# Altium schematic sheet Power Source.SchDoc: Power Architechture Block Diagram
size A3; DocumentNumber: 2; SheetNumber: 2; SheetTotal: 54
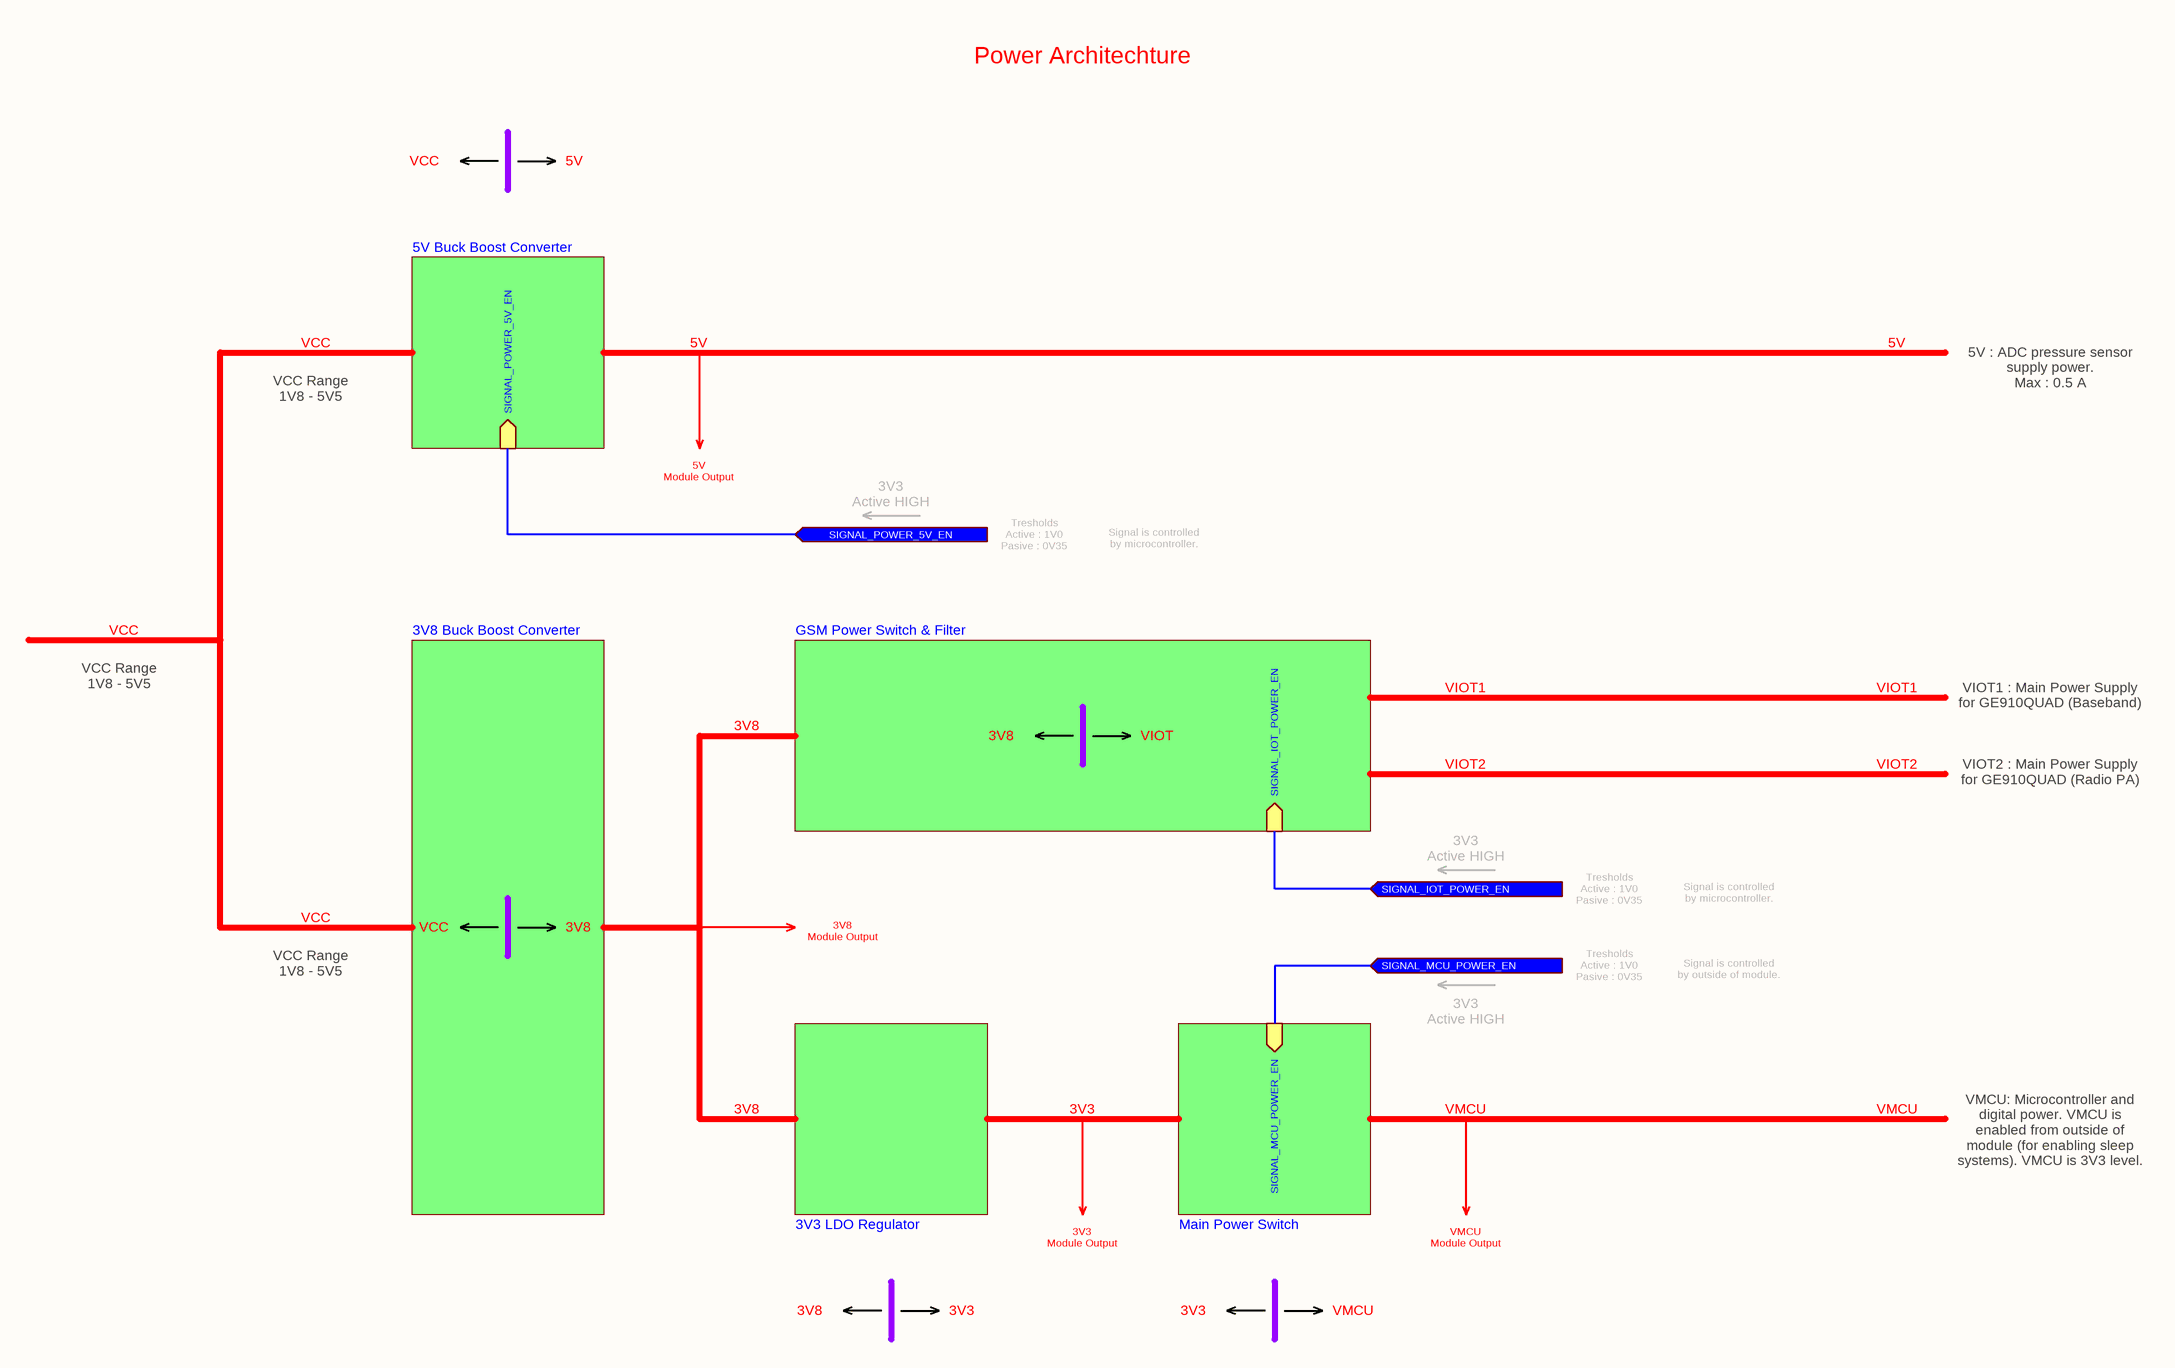
[diagram p0: Power Source.SchDoc]

## Sub-sheets
3V3 LDO Regulator = 3V3 LDO Regulator.SchDoc: no entries
3V8 Buck Boost Converter = 3V8 Buck Boost Converter.SchDoc: no entries
5V Buck Boost Converter = 5V Buck Boost Converter.SchDoc: SIGNAL_POWER_5V_EN (in)
GSM Power Switch & Filter = GSM Power.SchDoc: SIGNAL_IOT_POWER_EN (in)
Main Power Switch = Main Power Switch.SchDoc: SIGNAL_MCU_POWER_EN (in)

## Ports
SIGNAL_IOT_POWER_EN (in), SIGNAL_MCU_POWER_EN (in), SIGNAL_POWER_5V_EN (in)

## Nets
SIGNAL_IOT_POWER_EN: port SIGNAL_IOT_POWER_EN, sheet GSM Power Switch & Filter/SIGNAL_IOT_POWER_EN
SIGNAL_MCU_POWER_EN: port SIGNAL_MCU_POWER_EN, sheet Main Power Switch/SIGNAL_MCU_POWER_EN
SIGNAL_POWER_5V_EN: port SIGNAL_POWER_5V_EN, sheet 5V Buck Boost Converter/SIGNAL_POWER_5V_EN

## Notes on the sheet
- Power Architechture
- VCC
- 5V
- VCC Range
  1V8 - 5V5
- 5V
  Module Output
- 5V : ADC pressure sensor supply power.
  Max : 0.5 A
- 3V3
  Active HIGH
- Tresholds
  Active : 1V0
  Pasive : 0V35
- Signal is controlled by microcontroller.
- 3V8
- VIOT
- VIOT2
- VIOT1
- VIOT1 : Main Power Supply for GE910QUAD (Baseband)
- VIOT2 : Main Power Supply for GE910QUAD (Radio PA)
- 3V8
  Module Output
- Signal is controlled by outside of module.
- 3V3
- VMCU
- 3V3
  Module Output
- VMCU
  Module Output
- VMCU: Microcontroller and digital power. VMCU is enabled from outside of module (for enabling sleep systems). VMCU is 3V3 level.
- Title
- Size:
- Date:
- A3
- Number:
- Time:
- Revision:
- Sheet
- of
- File: